# EasyEDA schematic EasyEda_SCH_tally light - led matrix_2024-01-21.json
TITLE: tally light - leds; REV: 1.0; Date: 2023-06-16; Sheet: 1/1; Drawn By: michal123456747; Company: Michal Ramus
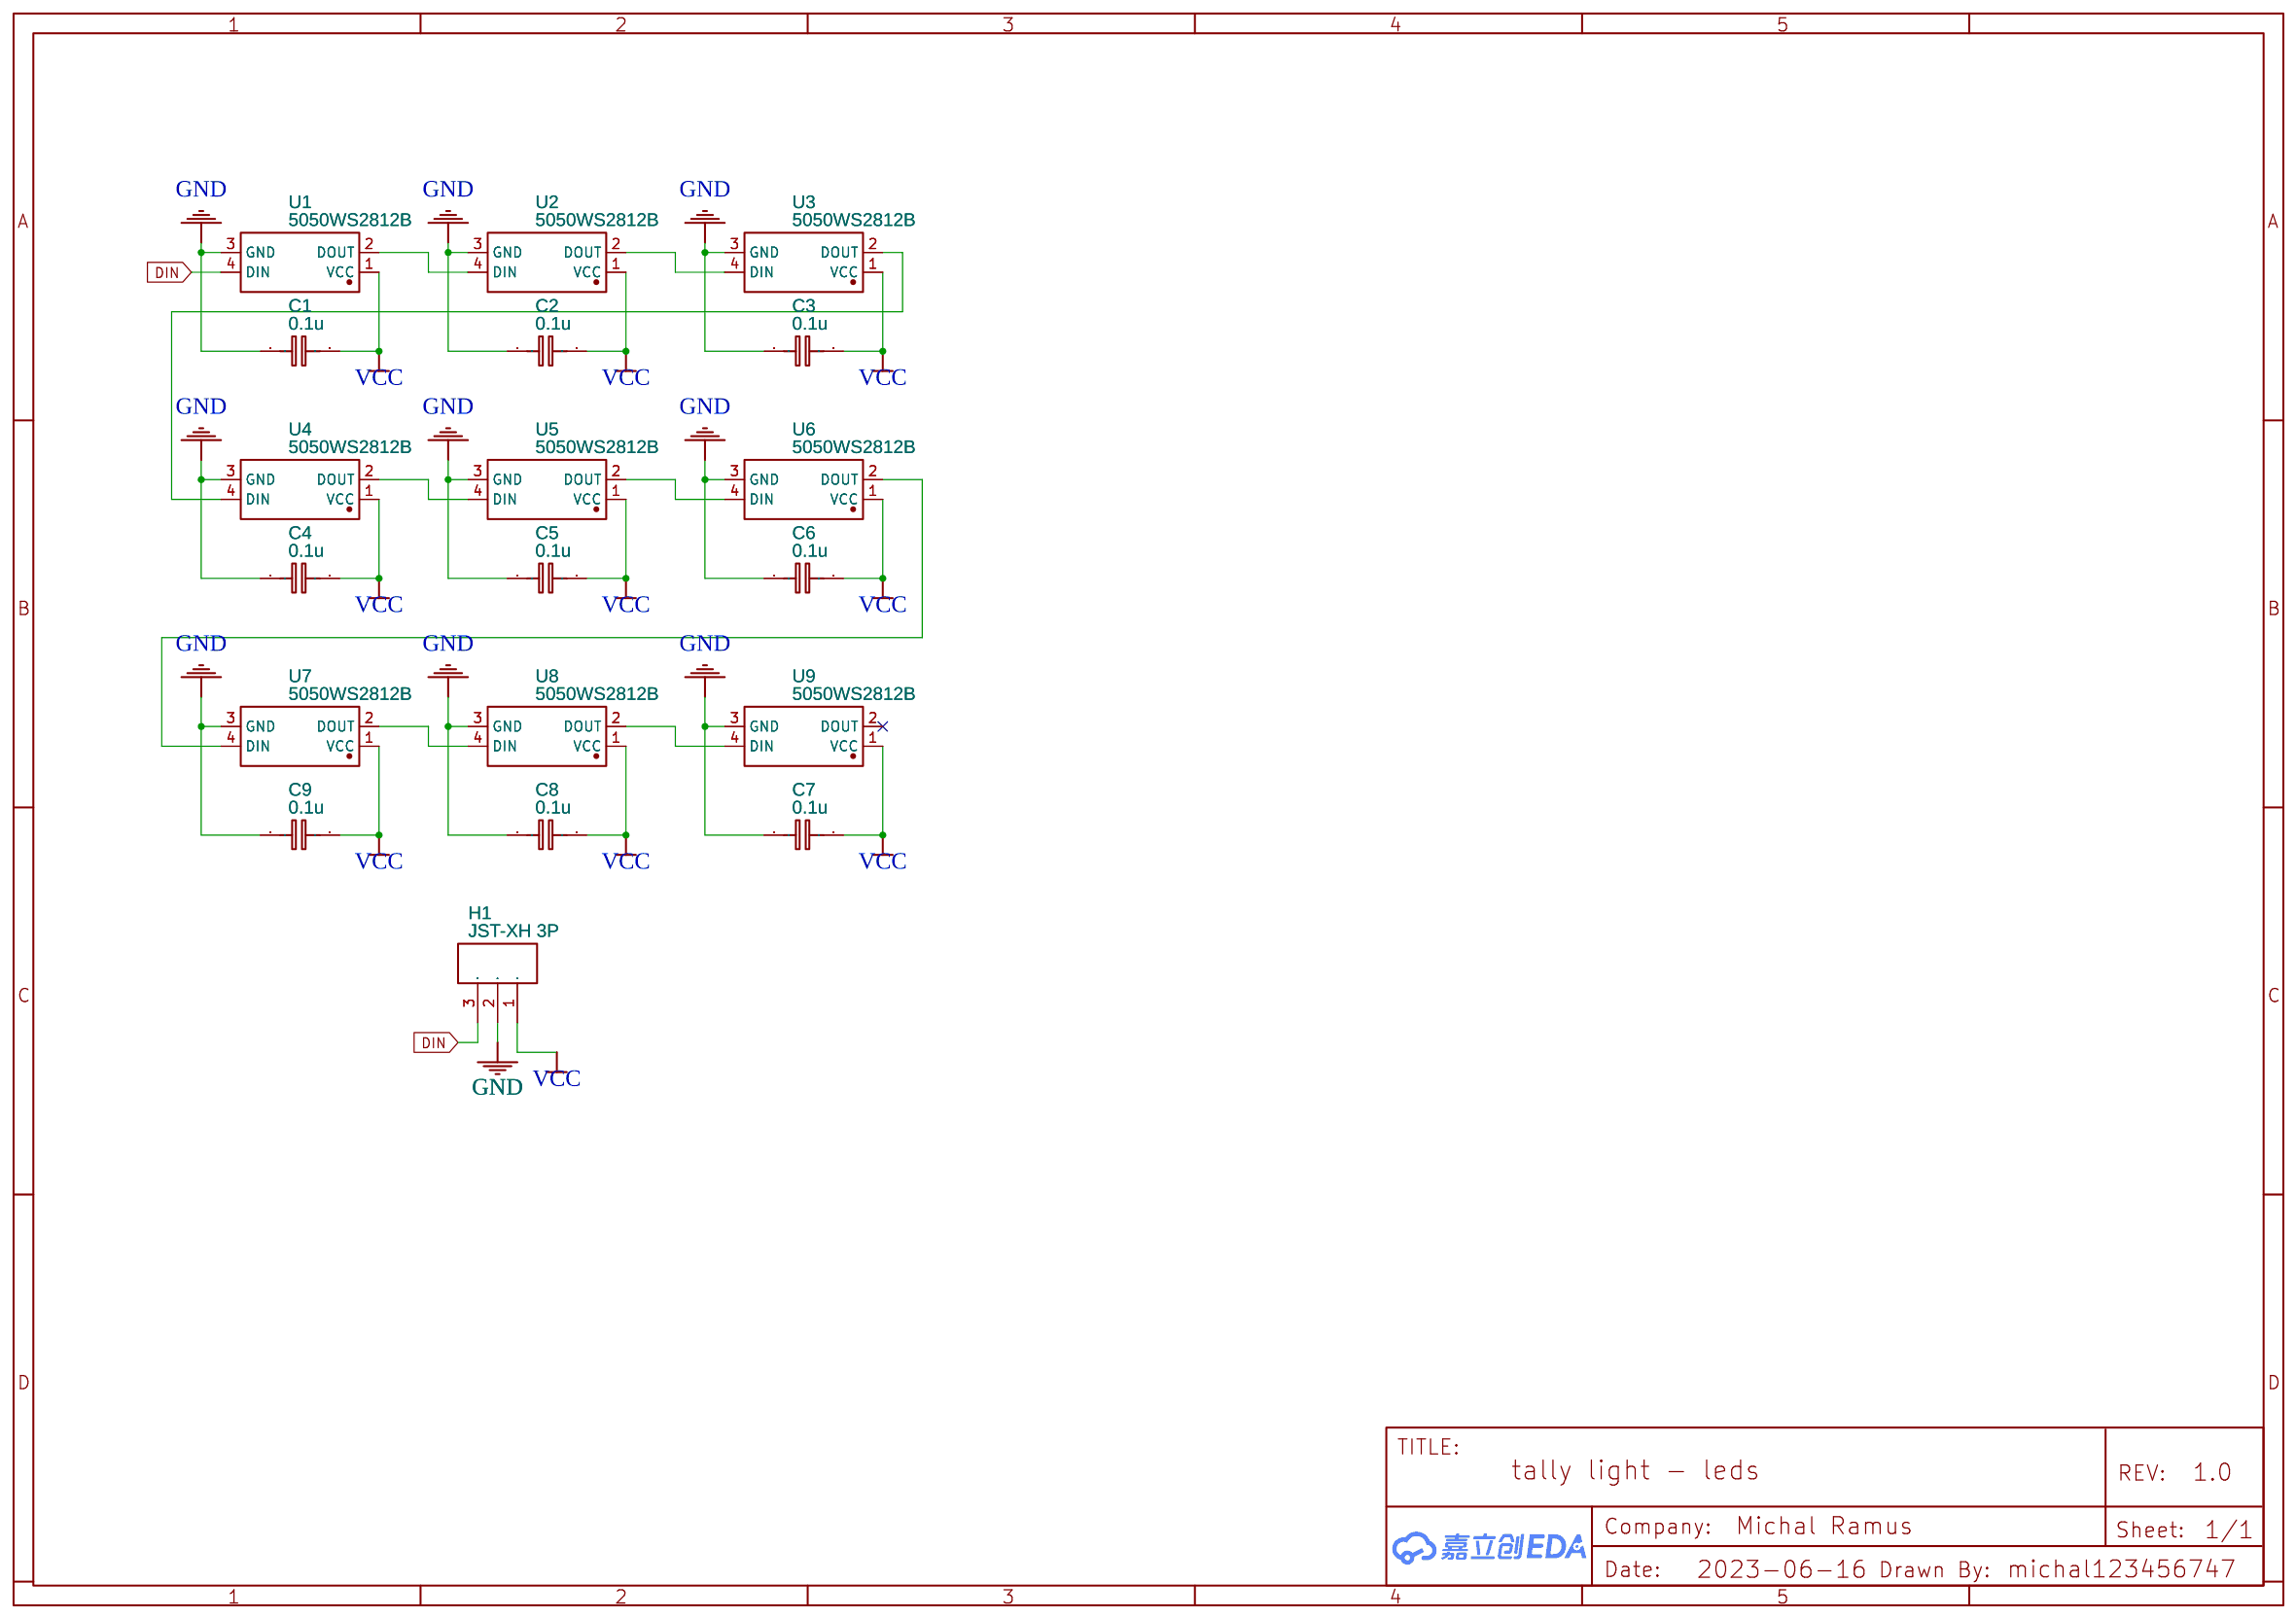
[diagram p0: schematic sheet]

## Parts
C1  0.1u  [C0603]
C2  0.1u  [C0603]
C3  0.1u  [C0603]
C4  0.1u  [C0603]
C5  0.1u  [C0603]
C6  0.1u  [C0603]
C7  0.1u  [C0603]
C8  0.1u  [C0603]
C9  0.1u  [C0603]
H1  JST-XH 3P  [3PIN_2.54_MM_JST_XHP_JST_CONNECTOR_FOR_DC_SOCKET]
U1  5050WS2812B  [LED-SMD_5050WS2812B]
U2  5050WS2812B  [LED-SMD_5050WS2812B]
U3  5050WS2812B  [LED-SMD_5050WS2812B]
U4  5050WS2812B  [LED-SMD_5050WS2812B]
U5  5050WS2812B  [LED-SMD_5050WS2812B]
U6  5050WS2812B  [LED-SMD_5050WS2812B]
U7  5050WS2812B  [LED-SMD_5050WS2812B]
U8  5050WS2812B  [LED-SMD_5050WS2812B]
U9  5050WS2812B  [LED-SMD_5050WS2812B]

## Library data of the parts
C1-C9 = C_0603_EU: Contributor: LCEDA_Lib
H1 = JST-XH 3P: Contributor: irukaict; subpart_no: 1
U1-U9 = 5050WS2812B: Supplier: LCSC; Supplier Part: C2874876; Manufacturer: null; JLCPCB Part Class: Extended Part; Contributor: LCSC

## Nets
GND: C1.1 C2.1 C3.1 C4.1 C5.1 C6.1 C7.1 C8.1 C9.1 H1.2 U1.3(GND) U2.3(GND) U3.3(GND) U4.3(GND) U5.3(GND) U6.3(GND) U7.3(GND) U8.3(GND) U9.3(GND)
VCC: C1.2 C2.2 C3.2 C4.2 C5.2 C6.2 C7.2 C8.2 C9.2 H1.1 U1.1(VCC) U2.1(VCC) U3.1(VCC) U4.1(VCC) U5.1(VCC) U6.1(VCC) U7.1(VCC) U8.1(VCC) U9.1(VCC)
DIN: H1.3 U1.4(DIN)
Net-(U1-2): U1.2(DOUT) U2.4(DIN)
Net-(U2-2): U2.2(DOUT) U3.4(DIN)
Net-(U3-2): U3.2(DOUT) U4.4(DIN)
Net-(U4-2): U4.2(DOUT) U5.4(DIN)
Net-(U5-2): U5.2(DOUT) U6.4(DIN)
Net-(U6-2): U6.2(DOUT) U7.4(DIN)
Net-(U7-2): U7.2(DOUT) U8.4(DIN)
Net-(U8-2): U8.2(DOUT) U9.4(DIN)

Not connected (* = marked no-connect by the designer): U9 2(DOUT)*
